# EAGLE design PSU (EAGLE 9.2.2)
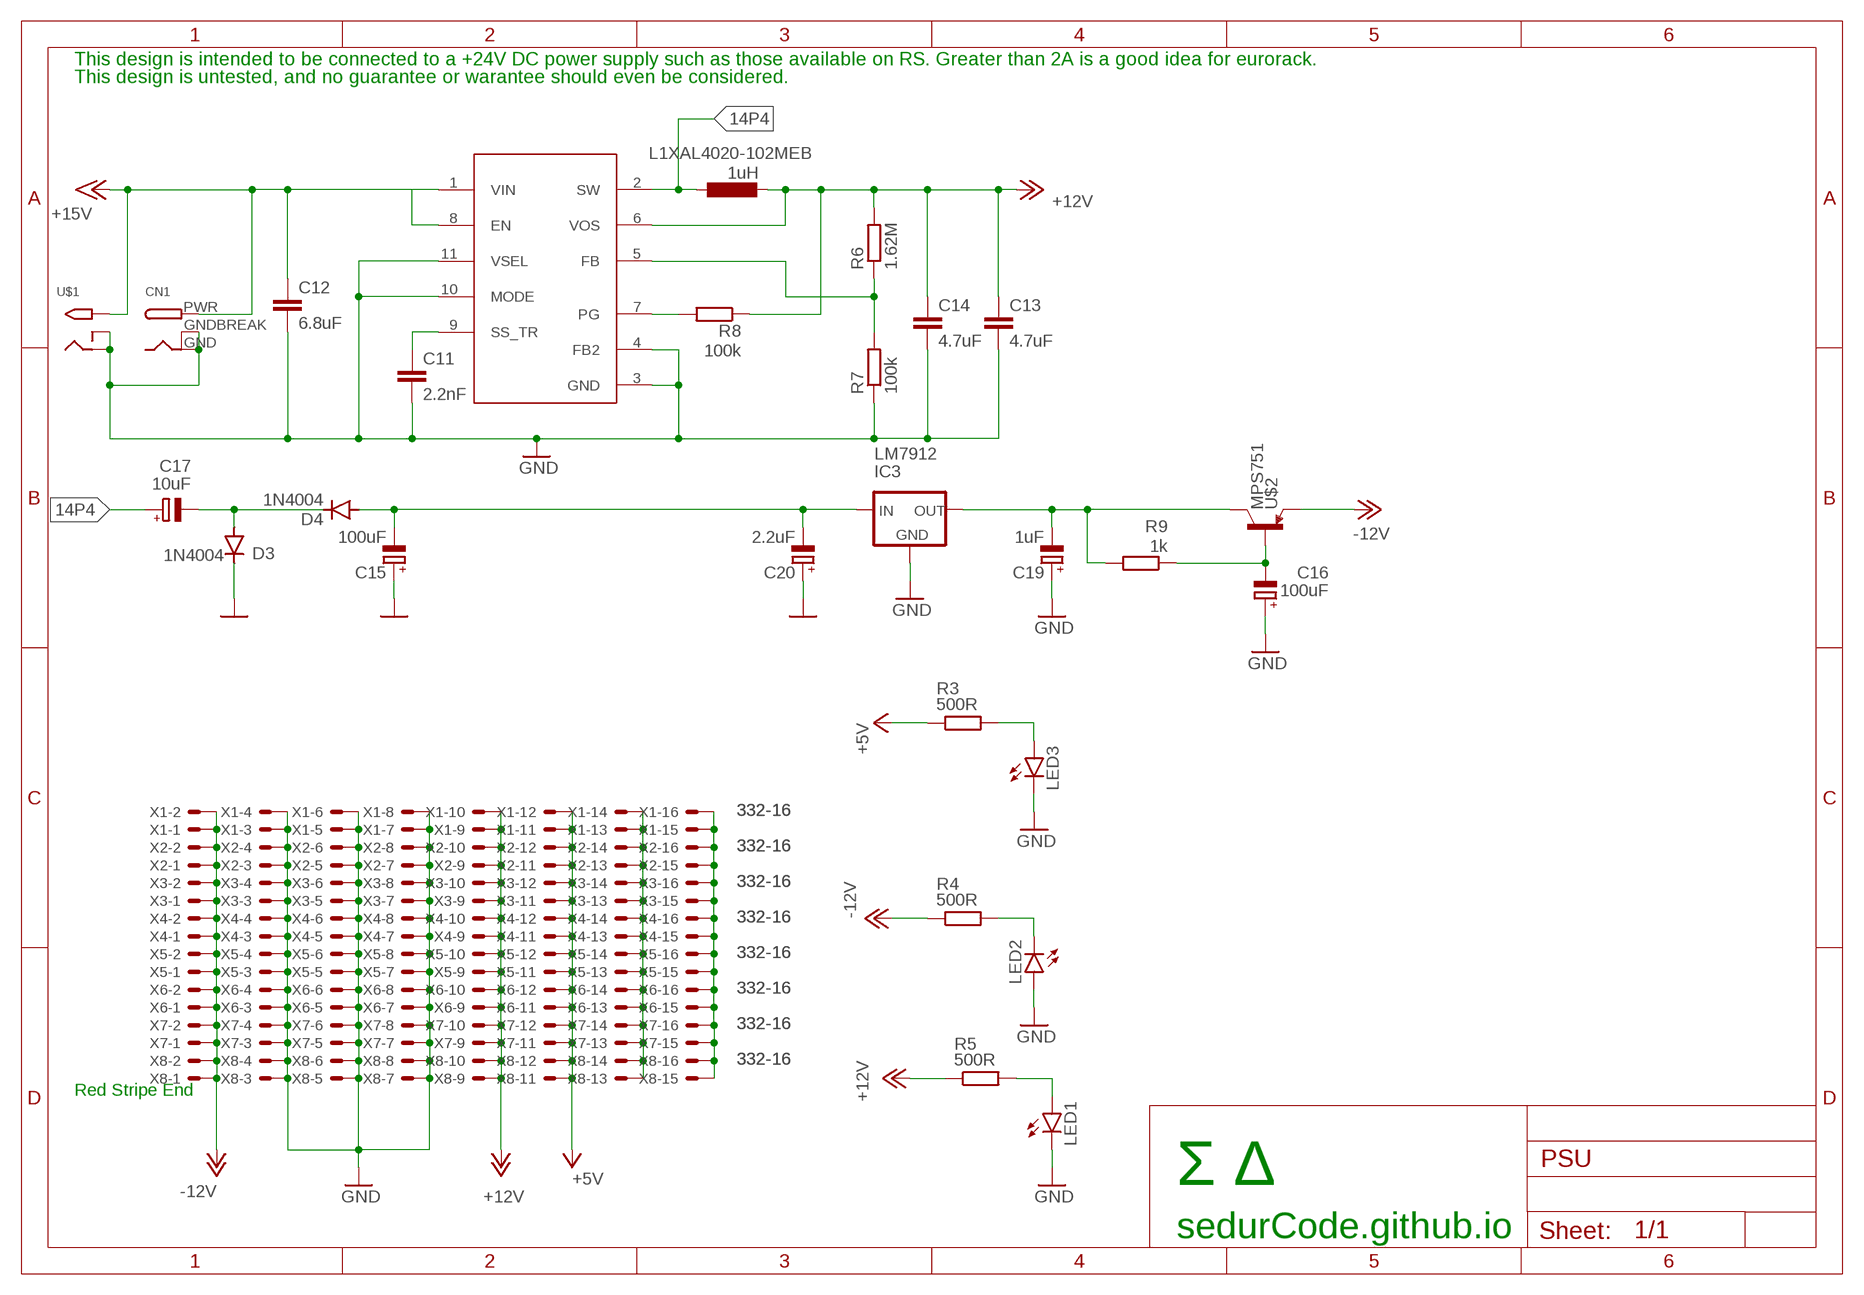
[diagram p0: schematic, sheet 1]

## Parts
C11  2.2nF  C-EUC0805  [C0805]
C12  6.8uF  C-EUC0805  [C0805]
C13  4.7uF  C-EUC0805  [C0805]
C14  4.7uF  C-EUC0805  [C0805]
C15  100uF  CPOL-EUB  [PANASONIC_B]
C16  100uF  CPOL-EUB  [PANASONIC_B]
C17  10uF  CPOL-EUB  [PANASONIC_B]
C19  1uF  CPOL-EUB  [PANASONIC_B]
C20  2.2uF  CPOL-EUB  [PANASONIC_B]
CN1  DCBARRELPTH  [DCJACK_2MM_PTH]
D3  1N4004  [DO41-10]
D4  1N4004  [DO41-10]
IC3  LM7912  79XXL  [79XXL]
L1XAL4020-102MEB  1uH  L-EUL5038P  [L5038P]
LED1  LED5MM  [LED5MM]
LED2  LED5MM  [LED5MM]
LED3  LED5MM  [LED5MM]
R3  500R  R-EU_0207/7  [0207/7]
R4  500R  R-EU_0207/7  [0207/7]
R5  500R  R-EU_0207/7  [0207/7]
R6  1.62M  R-EU_R0805  [R0805]
R7  100k  R-EU_R0805  [R0805]
R8  100k  R-EU_R0805  [R0805]
R9  1k  R-EU_R0805  [R0805]
U2  Value  TPS62135RGXR  [RGX0011A]
U$1  2.1MMJACKTHM  [PJ-102A]
U$2  MPS751  [TO92-EBC]
X1  332-16  [332-16]
X2  332-16  [332-16]
X3  332-16  [332-16]
X4  332-16  [332-16]
X5  332-16  [332-16]
X6  332-16  [332-16]
X7  332-16  [332-16]
X8  332-16  [332-16]

## Nets
10: U2.8(EN)
14P4: C17.+ L1XAL4020-102MEB.1 U2.2(SW)
+5V: R3.1 X1.11 X1.12 X2.11 X2.12 X3.11 X3.12 X4.11 X4.12 X5.11 X5.12 X6.11 X6.12 X7.11 X7.12 X8.11 X8.12
+12V: C13.1 C14.1 L1XAL4020-102MEB.2 R5.1 R6.2 R8.1 U2.6(VOS) X1.9 X1.10 X2.9 X2.10 X3.9 X3.10 X4.9 X4.10 X5.9 X5.10 X6.9 X6.10 X7.9 X7.10 X8.9 X8.10
+15V: C12.1 CN1.PWR U2.1(VIN) U$1.TIP
-12V: R4.1 U$2.E X1.1 X1.2 X2.1 X2.2 X3.1 X3.2 X4.1 X4.2 X5.1 X5.2 X6.1 X6.2 X7.1 X7.2 X8.1 X8.2
GND: C11.2 C12.2 C13.2 C14.2 C15.+ C16.+ C19.+ C20.+ CN1.GND CN1.GNDBREAK D3.C IC3.GND LED1.K(C) LED2.A LED3.K(C) R7.1 U2.3(GND) U2.4(FB2) U2.10(MODE) U2.11(VSEL) U$1.RING U$1.RING_SW X1.3 X1.4 X1.5 X1.6 X1.7 X1.8 X2.3 X2.4 X2.5 X2.6 X2.7 X2.8 X3.3 X3.4 X3.5 X3.6 X3.7 X3.8 X4.3 X4.4 X4.5 X4.6 X4.7 X4.8 X5.3 X5.4 X5.5 X5.6 X5.7 X5.8 X6.3 X6.4 X6.5 X6.6 X6.7 X6.8 X7.3 X7.4 X7.5 X7.6 X7.7 X7.8 X8.3 X8.4 X8.5 X8.6 X8.7 X8.8
N$1: R8.2 U2.7(PG)
N$3: C15.- C20.- D4.A IC3.IN
N$9: C19.- IC3.OUT R9.2 U$2.C
N$10: C11.1 U2.9(SS_TR)
N$11: R6.1 R7.2 U2.5(FB)
N$12: C16.- R9.1 U$2.B
N$13: C17.- D3.A D4.C
N$14: LED1.A R5.2
N$18: LED2.K(C) R4.2
N$19: X1.15 X1.16 X2.15 X2.16 X3.15 X3.16 X4.15 X4.16 X5.15 X5.16 X6.15 X6.16 X7.15 X7.16 X8.15 X8.16
N$20: X1.13 X1.14 X2.13 X2.14 X3.13 X3.14 X4.13 X4.14 X5.13 X5.14 X6.13 X6.14 X7.13 X7.14 X8.13 X8.14
N$21: LED3.A R3.2

## Notes on the sheet
- This design is intended to be connected to a +24V DC power supply such as those available on RS. Greater than 2A is a good idea for eurorack.
- This design is untested, and no guarantee or warantee should even be considered.
- Red Stripe End
- Σ Δ
- sedurCode.github.io

## Library data of the parts
C11-C14 = rcl:C-EU: CAPACITOR, European symbol; SPICEPREFIX: C
C15-C17 C19 C20 = rcl:CPOL-EU: POLARIZED CAPACITOR, European symbol; SPICEPREFIX: C
CN1 = adafruit:DCBARREL: 2.0mm DC Barrel Jack DCJACK_2MM_PTH - Through Hole Jack (4UConnector: 05537); SPICEPREFIX: X
D3 D4 = diode:1N4004: DIODE general purpose rectifier, 1 A
IC3 = v-reg:79XXL: VOLTAGE REGULATOR; SPICEPREFIX: J
L1XAL4020-102MEB = rcl:L-EU: INDUCTOR, European symbol; SPICEPREFIX: L
LED1-LED3 = led:LED: LED OSRAM: - CHIPLED LG R971, LG N971, LY N971, LG Q971, LY Q971, LO R971, LY R971 LH N974, LH R974 LS Q976, LO Q976, LY Q976 LO Q996 - Hyper CHIPLED LW Q18S LB Q993, LB Q99A, LB R99A - SideLED LS A670, LO A670, LY A670, LG A670, LP A670 LB A673, LV A673, LT A673, LW A673 LH A674 LY A675 LS A676, LA A676, LO A676, LY A676, LW A676 LS A679, LY A679, LG A679 - Hyper Micro SIDELED® LS Y876, LA Y876, LO Y876, LY Y876 LT Y87S - SmartLED LW L88C, LW L88S LB L89C, LB L89S, LG L890 LS L89K, LO L89K, LY L89K LS L896, LA L896, LO L896, LY L896 - TOPLED LS T670, LO T670, LY T670, LG T670, LP T670 LSG T670, LSP T670, LSY T670, LOP T670, LYG T670 LG T671, LOG T671, LSG T671 LB T673, LV T673, LT T673, LW T673 LH T674 LS T676, LA T676, LO T676, LY T676, LB T676, LH T676, LSB T676, LW T676 LB T67C, LV T67C, LT T67C, LS T67K, LO T67K, LY T67K, LW E67C LS E67B, LA E67B, LO E67B, LY E67B, LB E67C, LV E67C, LT E67C LW T67C LS T679, LY T679, LG T679 LS T770, LO T770, LY T770, LG T770, LP T770 LB T773, LV T773, LT T773, LW T773 LH T774 LS E675, LA E675, LY E675, LS T675 LS T776, LA T776, LO T776, LY T776, LB T776 LHGB T686 LT T68C, LB T68C - Hyper Mini TOPLED® LB M676 - Mini TOPLED Santana® LG M470 LS M47K, LO M47K, LY M47K Source: http://www.osram.convergy.de LUXEON: - LUMILED® LXK2-PW12-R00, LXK2-PW12-S00, LXK2-PW14-U00, LXK2-PW14-V00 LXK2-PM12-R00, LXK2-PM12-S00, LXK2-PM14-U00 LXK2-PE12-Q00, LXK2-PE12-R00, LXK2-PE12-S00, LXK2-PE14-T00, LXK2-PE14-U00 LXK2-PB12-K00, LXK2-PB12-L00, LXK2-PB12-M00, LXK2-PB14-N00, LXK2-PB14-P00, LXK2-PB14-Q00 LXK2-PR12-L00, LXK2-PR12-M00, LXK2-PR14-Q00, LXK2-PR14-R00 LXK2-PD12-Q00, LXK2-PD12-R00, LXK2-PD12-S00 LXK2-PH12-R00, LXK2-PH12-S00 LXK2-PL12-P00, LXK2-PL12-Q00, LXK2-PL12-R00 Source: www.luxeon.com KINGBRIGHT: KA-3528ASYC Source: www.kingbright.com
R3-R9 = rcl:R-EU_: RESISTOR, European symbol; SPICEPREFIX: R
U2 = texas12vsupply:TPS62135RGXR; MANUFACTURER: Texas Instruments; MANUFACTURER_NAME: Texas Instruments; MANUFACTURER_PART_NUMBER: TPS62135RGXR; PARTNUMBER: TPS62135RGXR; REFDES: RefDes; TYPE: TYPE
U$1 = adafruit:2.1MMJACK: 2.1mm x 5.5mm THM DC jack with internal switch. Digikey part #PJ-102A, 4UCON part #05537 2.1mm x 5.5mm SMT DC jack with internal switch. Digikey part #PJ-002A-SMT, 4UCON part #03267 By microbuilder.eu & adafruit.com
U$2 = audioic:MPS751
X1-X8 = con-garry:332-16: 16 Pin - 2mm Dual Row Source: www.mpe-connector.de / garry_shortform_2012.pdf

## Board
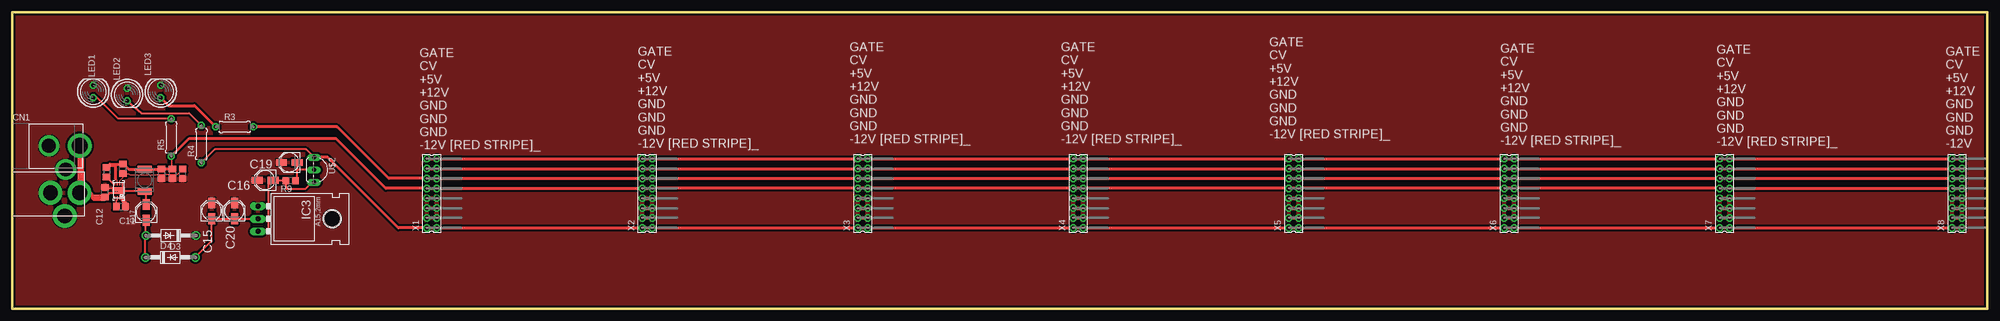
[diagram p1: board, top side]

Size 400 x 60 mm. Coordinates in mm from the lower left corner, seen from the top.
Outline: 0,0 0,60 400,60 400,0 0,0
Copper layers 16: Bottom 0.035mm
Design rules "eC_1Layer_PClass6_BaseCopperO35_eCDefault": minimum track width 0.15mm, minimum drill 0.35mm, track to track 0.15mm, track to pad 0.15mm, pad to pad 0.15mm, via to via 0.15mm, smd to smd 0mil, copper to edge 0.25mm, drill to drill 0.35mm, minimum pad ring 0.3mm, minimum via ring 0.3mm, stop-mask expansion 0mil, vias tented up to drill 0.45mm, thermal gap 0.2mm

### Footprints (pad centres in the part's own frame; a part is rotated, then mirrored left to right if it is on the bottom)
C0805 = smd 1.3 x 1.5: 1 -0.95,0; 2 0.95,0
PANASONIC_B = smd 2.2 x 1.4: + 1.6,0; - -1.6,0
DCJACK_2MM_PTH = drill 2.8: GND 0,7.35; GNDBREAK 4.8,10.75 | drill 3.2: PWR 0,13.6
DO41-10 = drill 1.118: A 5.08,0; C -5.08,0
79XXL = drill 1.016 long: GND -2.54,-3.81; IN 0,-3.81; OUT 2.54,-3.81 | hole 3.302: 0,11.176
L5038P = smd 1.4 x 2.8: 1 -2.2,0; 2 2.2,0
LED5MM = drill 0.813 octagon: A -1.27,0; K 1.27,0
0207/7 = drill 0.813 octagon: 1 -3.81,0; 2 3.81,0
R0805 = smd 1.3 x 1.5: 1 -0.95,0; 2 0.95,0
RGX0011A = smd 2.5 x 0.35: 1 0,0.5; 2 0,0; 3 0,-0.5 | smd 0.25 x 0.6: 4 -0.75,-1.4; 5 -0.25,-1.4; 6 0.25,-1.4; 7 0.75,-1.4; 8 0.75,1.4; 9 0.25,1.4; 10 -0.25,1.4; 11 -0.75,1.4
PJ-102A = drill 3 pad 4.8: RING 0.1,-3.39; RING_SW -4.6,-6.29; TIP 0.1,-9.29
TO92-EBC = drill 0.813 long: B 0,-1.27; C 2.54,-1.27; E -2.54,-1.27
332-16 = drill 0.9 pad 1.27: 1 -7,-1; 2 -7,1; 3 -5,-1; 4 -5,1; 5 -3,-1; 6 -3,1; 7 -1,-1; 8 -1,1; 9 1,-1; 10 1,1; 11 3,-1; 12 3,1; 13 5,-1; 14 5,1; 15 7,-1; 16 7,1

### Placement (x,y rotation side)
C11  22,20.7 0 top
C12  18.8,23.6 90 top
C13  32.4,27.3 270 top
C14  30.2,27.3 270 top
C15  40.4,19.8 90 top
C16  56.1,29.6 180 top
C17  27.1,19.5 90 top
C19  51.2,26 180 top
C20  45,19.8 90 top
CN1  0.05,32.97 270 top
D3  32.1,14.8 180 top
D4  32,10.4 0 top
IC3  53.6,18.2 270 top
L1XAL4020-102MEB  26.8,26 90 top
LED1  16.39,43.95 90 top
LED2  23.23,43.32 270 top
LED3  30.07,43.95 90 top
R3  45.03,36.81 180 top
R4  38.29,33.32 90 top
R5  32.19,34.66 90 top
R6  22.4,28.3 90 top
R7  34.5,27.3 90 top
R8  19.1,27.6 270 top
R9  56.4,25.9 180 top
U2  21.5,23.9 180 top
U$1  4.33,23.35 90 top
U$2  62.4,28.1 270 top
X1  84.95,23.36 90 top
X2  128.59,23.36 90 top
X3  172.24,23.36 90 top
X4  215.88,23.36 90 top
X5  259.53,23.36 90 top
X6  303.17,23.36 90 top
X7  346.81,23.36 90 top
X8  393.9,23.36 90 top

### Tracks (layer width: path | path; a pad name or v marks a point on that pad's centre or on a via)
14P4
  Top 0.2: 26.7,23.9 L1XAL4020-102MEB.1
  Top 0.406: C17.+ 27.1,23.5 L1XAL4020-102MEB.1 | U2.2 26.7,23.9
+5V
  Top 0.61: R3.1 65.79,36.81 76.24,26.36 X1.12 X1.11 X2.12 X2.11 X3.12 X3.11 X4.12 X4.11 X5.12 X5.11 X6.12 X6.11 X7.12 X7.11 X8.12 X8.11
+12V
  Top 0.203: U2.6 21.25,25.95 20.9,26.3
  Top 0.305: R5.1 C13.1
  Top 0.61: R5.1 35.84,34.5 65.51,34.5 75.65,24.36 X1.10 X1.9 X2.10 X2.9 X3.10 X3.9 X4.10 X4.9 X5.10 X5.9 X6.10 X6.9 X7.10 X7.9 X8.10 X8.9 | C13.1 C14.1 30.15,28.2 L1XAL4020-102MEB.2 23.59,28.2 22.54,29.25 R6.2 19.8,29.25 R8.1 19.45,28.9 20.9,28.9 20.9,26.3
+15V
  Top 0.406: U2.1 19.7,23.4 18.95,22.65 C12.1
  Top 0.813: 16.6,22.5 15.65,23.45 U$1.TIP 13.85,23.68 | 18.65,22.5 C12.1
  Top 1.27: 16.6,22.5 18.65,22.5 | CN1.PWR 13.85,32.77 13.85,23.68
-12V
  Top 0.406: 61.1,30.61 U$2.E 59.51,32.26 41.04,32.26 R4.1
  Top 0.61: 61.1,30.61 63.9,30.61 78.15,16.36 X1.2 X1.1 X2.2 X2.1 X3.2 X3.1 X4.2 X4.1 X5.2 X5.1 X6.2 X6.1 X7.2 X7.1 X8.2 X8.1
GND
  Top 0.305: U2.4 22.32,24.41 U2.3 | U2.10 U2.11 | C12.2 18.94,24.41 U2.3 | U2.3
  Top 0.406: X8.7 X8.8
  Top 0.61: X2.4 X2.3 | X3.4 X3.3 | X4.4 X4.3 | X5.4 X5.3 | X7.4 X7.3 | X8.4 X8.3 | X2.8 X2.7 | X3.8 X3.7 | X4.8 X4.7 | X5.8 X5.7 | X6.8 X6.7 | X7.8 X7.7 | X2.6 X2.5 | X3.6 X3.5 | X4.6 X4.5 | X5.6 X5.5 | X6.6 X6.5 | X7.6 X7.5 | X8.6 X8.5 | X6.4 X6.3
  Top 0.813: U2.11 C11.2
  pour Top (isolate 0.406): 0.2,60.1 0.2,0.6 0.5,0.3 399.6,0.3 399.6,59.5 399.7,59.6 0.5,59.8
N$1
  Top 0.254: U2.7 20.45,25.3 R8.2
N$3
  Top 0.406: IC3.IN C20.- C15.- 40.4,13.72 D4.A
N$9
  Top 0.406: IC3.OUT 51.16,15.66 51.9,16.4 51.9,25.1 C19.- 55.35,26 R9.2 55.5,25.85 55.5,24.3 55.6,24.2 59.3,24.2 60.66,25.56 U$2.C
N$10
  Top 0.305: U2.9 21.25,22.05 21.05,21.85 C11.1
N$11
  Top 0.2: U2.5 21.63,25.42 21.63,25.78 22.4,26.55 R6.1 23.55,27.35 23.8,27.1 29,27.1 29.19,27.1 29.34,27.25 33.5,27.25 R7.2
N$12
  Top 0.406: R9.1 57.7,26.25 57.7,28.2 | 57.7,28.2 C16.- | U$2.B 57.8,28.1 57.7,28.2
N$13
  Top 0.406: D4.C 26.92,14.7 D3.A 27.02,17.82 C17.-
N$14
  Top 0.406: R5.2 21.43,38.47 17.21,42.69 LED1.A
N$18
  Top 0.406: LED2.K 26.19,39.6 35.82,39.6 R4.2
N$19
  Top 0.61: X1.16 X1.15 X2.16 X2.15 X3.16 X3.15 X4.16 X4.15 X5.16 X5.15 X6.16 X6.15 X7.16 X7.15 X8.16 X8.15
N$20
  Top 0.61: X1.14 X1.13 X2.14 X2.13 X3.14 X3.13 X4.14 X4.13 X5.14 X5.13 X6.14 X6.13 X7.14 X7.13 X8.14 X8.13
N$21
  Top 0.61: LED3.A 31.66,41.1 36.93,41.1 R3.2

### Text on the board
_tsilk: GATE / CV / +5V / +12V / GND / GND / GND / -12V [RED STRIPE]_ | GATE / CV / +5V / +12V / GND / GND / GND / -12V [RED STRIPE]_ | GATE / CV / +5V / +12V / GND / GND / GND / -12V [RED STRIPE]_ | GATE / CV / +5V / +12V / GND / GND / GND / -12V [RED STRIPE]_ | GATE / CV / +5V / +12V / GND / GND / GND / -12V [RED STRIPE]_ | GATE / CV / +5V / +12V / GND / GND / GND / -12V [RED STRIPE]_ | GATE / CV / +5V / +12V / GND / GND / GND / -12V [RED STRIPE]_ | GATE / CV / +5V / +12V / GND / GND / GND / -12V